# Altium project 3Dprinter_shield (DESKTOP-GM7ATB6's conflicted copy 2018-08-09).PrjPcb
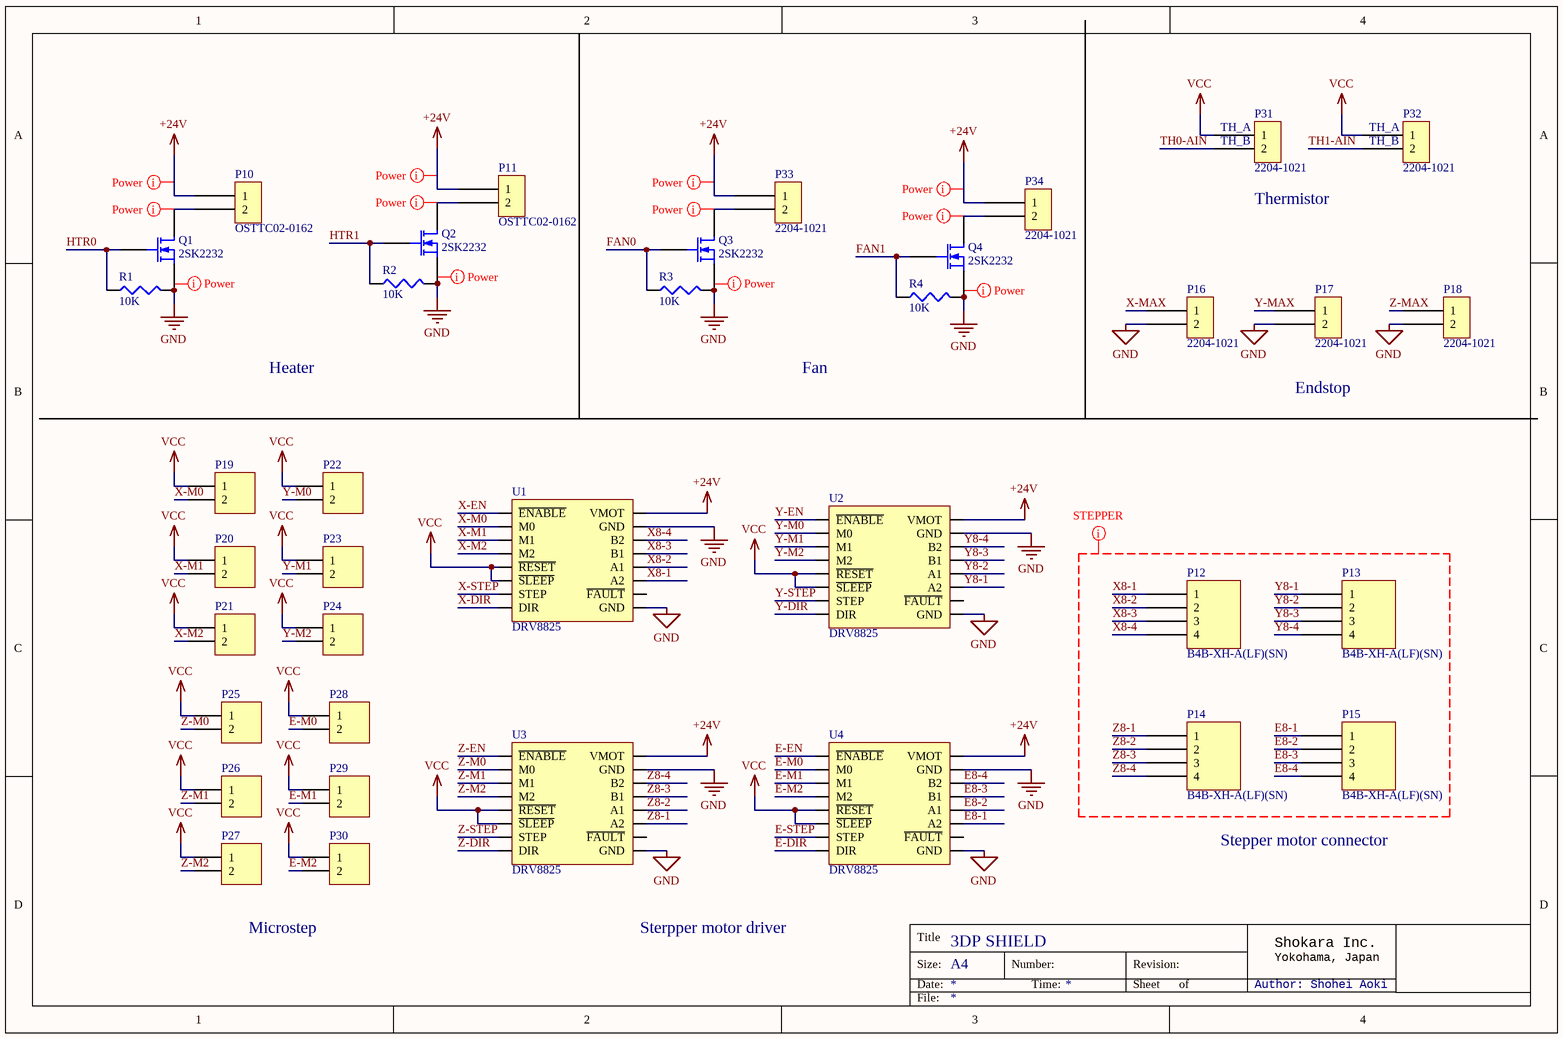
[diagram p0: Connector.SchDoc]
2 sheets, 54 parts. Net scope: global (net labels, ports and power ports of the same name join across sheets).
Board file: PCB.PcbDoc
Sheets:
  Connector.SchDoc
  Misc.SchDoc

## Sheet Connector.SchDoc
size A4; Author: Shohei Aoki; Organization: Shokara Inc.; Address1: Yokohama, Japan

### Parts
P10  OSTTC02-0162  [OSTTC02-0162]
P11  OSTTC02-0162  [OSTTC02-0162]
P12  B4B-XH-A(LF)(SN)  [B4B-XH-A]
P13  B4B-XH-A(LF)(SN)  [B4B-XH-A]
P14  B4B-XH-A(LF)(SN)  [B4B-XH-A]
P15  B4B-XH-A(LF)(SN)  [B4B-XH-A]
P16  2204-1021  [MOLEX_2204_1021]
P17  2204-1021  [MOLEX_2204_1021]
P18  2204-1021  [MOLEX_2204_1021]
P19  Header 2  [HDR1X2]  (value not drawn)
P20  Header 2  [HDR1X2]  (value not drawn)
P21  Header 2  [HDR1X2]  (value not drawn)
P22  Header 2  [HDR1X2]  (value not drawn)
P23  Header 2  [HDR1X2]  (value not drawn)
P24  Header 2  [HDR1X2]  (value not drawn)
P25  Header 2  [HDR1X2]  (value not drawn)
P26  Header 2  [HDR1X2]  (value not drawn)
P27  Header 2  [HDR1X2]  (value not drawn)
P28  Header 2  [HDR1X2]  (value not drawn)
P29  Header 2  [HDR1X2]  (value not drawn)
P30  Header 2  [HDR1X2]  (value not drawn)
P31  2204-1021  [MOLEX_2204_1021]
P32  2204-1021  [MOLEX_2204_1021]
P33  2204-1021  [MOLEX_2204_1021]
P34  2204-1021  [MOLEX_2204_1021]
Q1  2SK2232  [2SK2232]
Q2  2SK2232  [2SK2232]
Q3  2SK2232  [2SK2232]
Q4  2SK2232  [2SK2232]
R1  value 10K  [J1-0603]
R2  value 10K  [J1-0603]
R3  value 10K  [J1-0603]
R4  value 10K  [J1-0603]
U1  DRV8825  [DRV8825]
U2  DRV8825  [DRV8825]
U3  DRV8825  [DRV8825]
U4  DRV8825  [DRV8825]

### Nets
+24V: P10.1 P11.1 P33.1 P34.1 U1.VMOT U2.VMOT U3.VMOT U4.VMOT
GND: P16.2 P17.2 P18.2 Q1.S Q2.S Q3.S Q4.S R1.2 R2.2 R3.2 R4.2 U1.GND U2.GND U3.GND U4.GND
VCC: P19.1 P20.1 P21.1 P22.1 P23.1 P24.1 P25.1 P26.1 P27.1 P28.1 P29.1 P30.1 P31.1 P32.1 U1.RESET(~{RESET}) U1.SLEEP(~{SLEEP}) U2.RESET(~{RESET}) U2.SLEEP(~{SLEEP}) U3.RESET(~{RESET}) U3.SLEEP(~{SLEEP}) U4.RESET(~{RESET}) U4.SLEEP(~{SLEEP})  [project net +3V3]
E8-1: P15.1 U4.A2
E8-2: P15.2 U4.A1
E8-3: P15.3 U4.B1
E8-4: P15.4 U4.B2
E-DIR: U4.DIR
E-EN: U4.ENABLE(~{ENABLE})
E-M0: P28.2 U4.M0
E-M1: P29.2 U4.M1
E-M2: P30.2 U4.M2
E-STEP: U4.STEP
FAN0: Q3.G R3.1
FAN1: Q4.G R4.1
HTR0: Q1.G R1.1
HTR1: Q2.G R2.1
TH0-AIN: P31.2
TH1-AIN: P32.2
X8-1: P12.1 U1.A2
X8-2: P12.2 U1.A1
X8-3: P12.3 U1.B1
X8-4: P12.4 U1.B2
X-DIR: U1.DIR
X-EN: U1.ENABLE(~{ENABLE})
X-M0: P19.2 U1.M0
X-M1: P20.2 U1.M1
X-M2: P21.2 U1.M2
X-MAX: P16.1
X-STEP: U1.STEP
Y8-1: P13.1 U2.A2
Y8-2: P13.2 U2.A1
Y8-3: P13.3 U2.B1
Y8-4: P13.4 U2.B2
Y-DIR: U2.DIR
Y-EN: U2.ENABLE(~{ENABLE})
Y-M0: P22.2 U2.M0
Y-M1: P23.2 U2.M1
Y-M2: P24.2 U2.M2
Y-MAX: P17.1
Y-STEP: U2.STEP
Z8-1: P14.1 U3.A2
Z8-2: P14.2 U3.A1
Z8-3: P14.3 U3.B1
Z8-4: P14.4 U3.B2
Z-DIR: U3.DIR
Z-EN: U3.ENABLE(~{ENABLE})
Z-M0: P25.2 U3.M0
Z-M1: P26.2 U3.M1
Z-M2: P27.2 U3.M2
Z-MAX: P18.1
Z-STEP: U3.STEP
NetP10_2: P10.2 Q1.D
NetP11_2: P11.2 Q2.D
NetP33_2: P33.2 Q3.D
NetP34_2: P34.2 Q4.D

Not connected (* = marked no-connect by the designer): U1 FAULT(~{FAULT}); U2 FAULT(~{FAULT}); U3 FAULT(~{FAULT}); U4 FAULT(~{FAULT})

### Layout directives
net class Stepper: E8-1, E8-2, E8-3, E8-4, X8-1, X8-2, X8-3, X8-4, Y8-1, Y8-2, Y8-3, Y8-4, Z8-1, Z8-2, Z8-3, Z8-4
net class Power: (no net found under the mark), +24V, NetP10_2, NetP11_2, NetP33_2, NetP34_2

### Notes on the sheet
- (near P31) TH_A
- (near P31) TH_B
- (near P32) TH_A
- (near P32) TH_B
- (near P31) Thermistor
- Heater
- Fan
- Endstop
- Stepper motor connector
- Microstep
- Sterpper motor driver
- 3DP SHIELD
- Title
- Size:
- Date:
- A4
- Number:
- Time:
- Revision:
- Sheet
- of
- Author: Shohei Aoki
- Shokara Inc.
- Yokohama, Japan
- File:

### Library data of the parts
P10 P11 = TERMINAL_BLOCK_1X2
P12-P15 = XH_CONNECTOR_1X4
P16-P18 P31-P34 = MOLEX_1X2_HEADER
P19-P30 = Header 2: Header, 2-Pin; LatestRevisionDate: 17-Jul-2002; LatestRevisionNote: Re-released for DXP Platform.; Publisher: Altium Limited
R1-R4 = Res3: Resistor; Published: 8-Jun-2000; LatestRevisionDate: 29-May-2009; LatestRevisionNote: IPC-7351 Footprint Added.; PackageReference: J1-0603; Publisher: Altium Limited; PackageDescription: Chip Resistor

## Sheet Misc.SchDoc
size A4
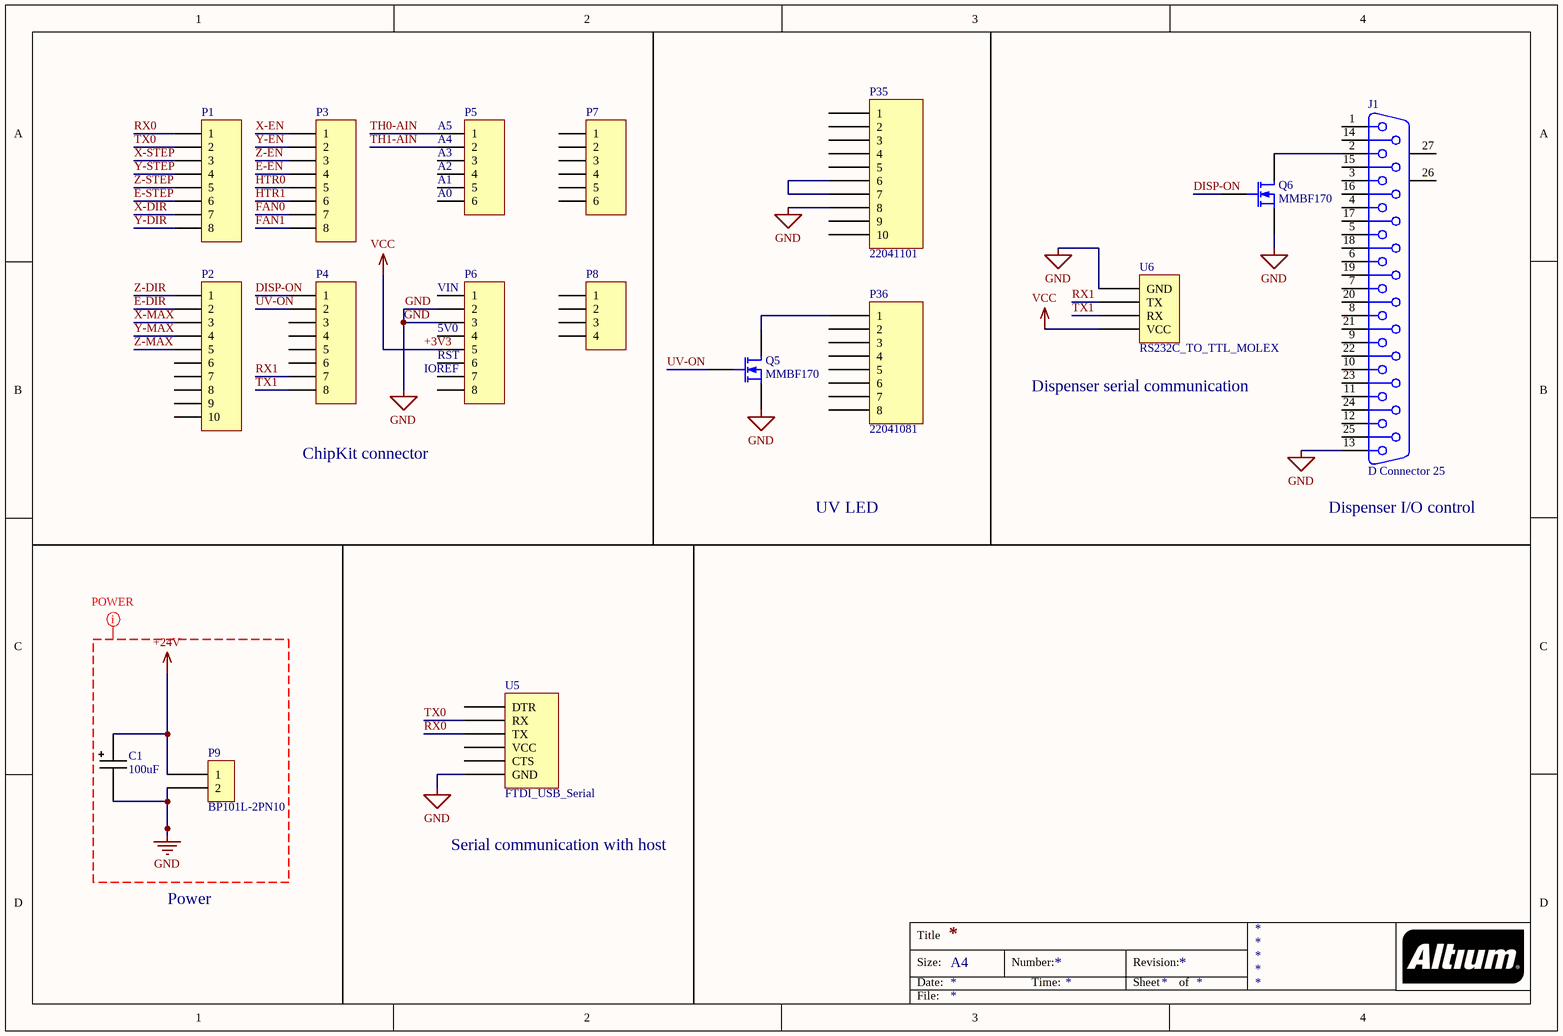
[diagram p1: Misc.SchDoc]

### Parts
C1  Cap_alumi_electrolytic  [EEE-1HA101UP]  (value not drawn)
J1  D Connector 25  [DSUB1.385-2H25A]
P1  (no value)  [HDR1X8]
P2  (no value)  [HDR1X10]
P3  (no value)  [HDR1X8]
P4  (no value)  [HDR1X8]
P5  (no value)  [HDR1X6]
P6  (no value)  [HDR1X8]
P7  (no value)  [HDR1X6]
P8  Header 4  [HDR1X4]  (value not drawn)
P9  BP101L-2PN10  [BP101L-2PN10]
P35  22041101  [PHOENIX_10PIN_MOLEX]
P36  22041081  [PHOENIX_8PIN_MOLEX]
Q5  MMBF170  [MMBF170-SOT95P240X130-3N]
Q6  MMBF170  [MMBF170-SOT95P240X130-3N]
U5  FTDI_USB_Serial  [FTDI_USB_Serial]
U6  RS232C_TO_TTL_MOLEX  [RS232C_TO_TTL_MOLEX]

### Nets
+3V3: P6.5 U6.VCC  [also labelled VCC]
+24V: C1.2 P9.1
GND: C1.1 J1.13 P6.2 P6.3 P9.2 P35.8 Q5.2(S) Q6.2(S) U5.6(GND) U6.GND
DISP-ON: P4.1 Q6.1(G)
E-DIR: P2.2
E-EN: P3.4
E-STEP: P1.6
FAN0: P3.7
FAN1: P3.8
HTR0: P3.5
HTR1: P3.6
RX0: P1.1 U5.3(TX)
RX1: P4.7 U6.TX
TH0-AIN: P5.1
TH1-AIN: P5.2
TX0: P1.2 U5.2(RX)
TX1: P4.8 U6.RX
UV-ON: P4.2 Q5.1(G)
X-DIR: P1.7
X-EN: P3.1
X-MAX: P2.3
X-STEP: P1.3
Y-DIR: P1.8
Y-EN: P3.2
Y-MAX: P2.4
Y-STEP: P1.4
Z-DIR: P2.1
Z-EN: P3.3
Z-MAX: P2.5
Z-STEP: P1.5
NetJ1_2: J1.2 Q6.3(D)
NetP35_6: P35.6 P35.7
NetP36_1: P36.1 Q5.3(D)

Not connected (* = marked no-connect by the designer): J1 1 3 4 5 6 7 8 9 10 11 12 14 15 16 17 18 19 20 21 22 23 24 25 26(MH1) 27(MH2); P2 6 7 8 9 10; P4 3 4 5 6; P5 3 4 5 6; P6 1 4 6 7 8; P7 1 2 3 4 5 6; P8 1 2 3 4; P35 1 2 3 4 5 9 10; P36 2 3 4 5 6 7 8; U5 1(DTR) 4(VCC) 5(CTS)

### Layout directives
net class Power: +24V, GND

### Notes on the sheet
- (near P5) A5
- (near P5) A4
- (near P5) A3
- (near P5) A2
- (near P5) A1
- (near P5) A0
- (near P6) VIN
- (near P6) IOREF
- (near P6) 5V0
- (near P6) RST
- (near U6) Dispenser serial communication
- ChipKit connector
- UV LED
- (near J1) Dispenser I/O control
- Serial communication with host
- Power
- Title
- Size:
- Date:
- Number:
- Time:
- Revision:
- Sheet
- of
- File:
- (in symbol Cap_alumi_electrolytic) 100uF

### Library data of the parts
J1 = D Connector 25: Receptacle Assembly, 25 Position, Right Angle; PackageDocument: U; Positions: 25; Published: 15-Jun-2001; LatestRevisionDate: 17-Jul-2002; LatestRevisionNote: Re-released for DXP Platform.; DatasheetDocument: 19-Mar-1999; PackageReference: 787202; Publisher: Altium Limited; Orientation: Right Angle; Gender: Receptacle
P1 P3 P4 P6 = Header 8: Header, 8-Pin; LatestRevisionDate: 17-Jul-2002; LatestRevisionNote: Re-released for DXP Platform.; Publisher: Altium Limited
P2 = Header 10: Header, 10-Pin; LatestRevisionDate: 17-Jul-2002; LatestRevisionNote: Re-released for DXP Platform.; Publisher: Altium Limited
P5 P7 = Header 6: Header, 6-Pin; LatestRevisionDate: 17-Jul-2002; LatestRevisionNote: Re-released for DXP Platform.; Publisher: Altium Limited
P8 = Header 4: Header, 4-Pin; LatestRevisionDate: 17-Jul-2002; LatestRevisionNote: Re-released for DXP Platform.; Publisher: Altium Limited
P35 = Phoenix_10pin_MOLEX
P36 = Phoenix_8pin_MOLEX

## Nets that join several sheets
+3V3: Connector (22 pins), Misc (P6.5 U6.VCC)
+24V: Connector (8 pins), Misc (C1.2 P9.1)
GND: Connector (15 pins), Misc (10 pins)
E-DIR: Connector (U4.DIR), Misc (P2.2)
E-EN: Connector (U4.ENABLE), Misc (P3.4)
E-STEP: Connector (U4.STEP), Misc (P1.6)
FAN0: Connector (Q3.G R3.1), Misc (P3.7)
FAN1: Connector (Q4.G R4.1), Misc (P3.8)
HTR0: Connector (Q1.G R1.1), Misc (P3.5)
HTR1: Connector (Q2.G R2.1), Misc (P3.6)
TH0-AIN: Connector (P31.2), Misc (P5.1)
TH1-AIN: Connector (P32.2), Misc (P5.2)
X-DIR: Connector (U1.DIR), Misc (P1.7)
X-EN: Connector (U1.ENABLE), Misc (P3.1)
X-MAX: Connector (P16.1), Misc (P2.3)
X-STEP: Connector (U1.STEP), Misc (P1.3)
Y-DIR: Connector (U2.DIR), Misc (P1.8)
Y-EN: Connector (U2.ENABLE), Misc (P3.2)
Y-MAX: Connector (P17.1), Misc (P2.4)
Y-STEP: Connector (U2.STEP), Misc (P1.4)
Z-DIR: Connector (U3.DIR), Misc (P2.1)
Z-EN: Connector (U3.ENABLE), Misc (P3.3)
Z-MAX: Connector (P18.1), Misc (P2.5)
Z-STEP: Connector (U3.STEP), Misc (P1.5)